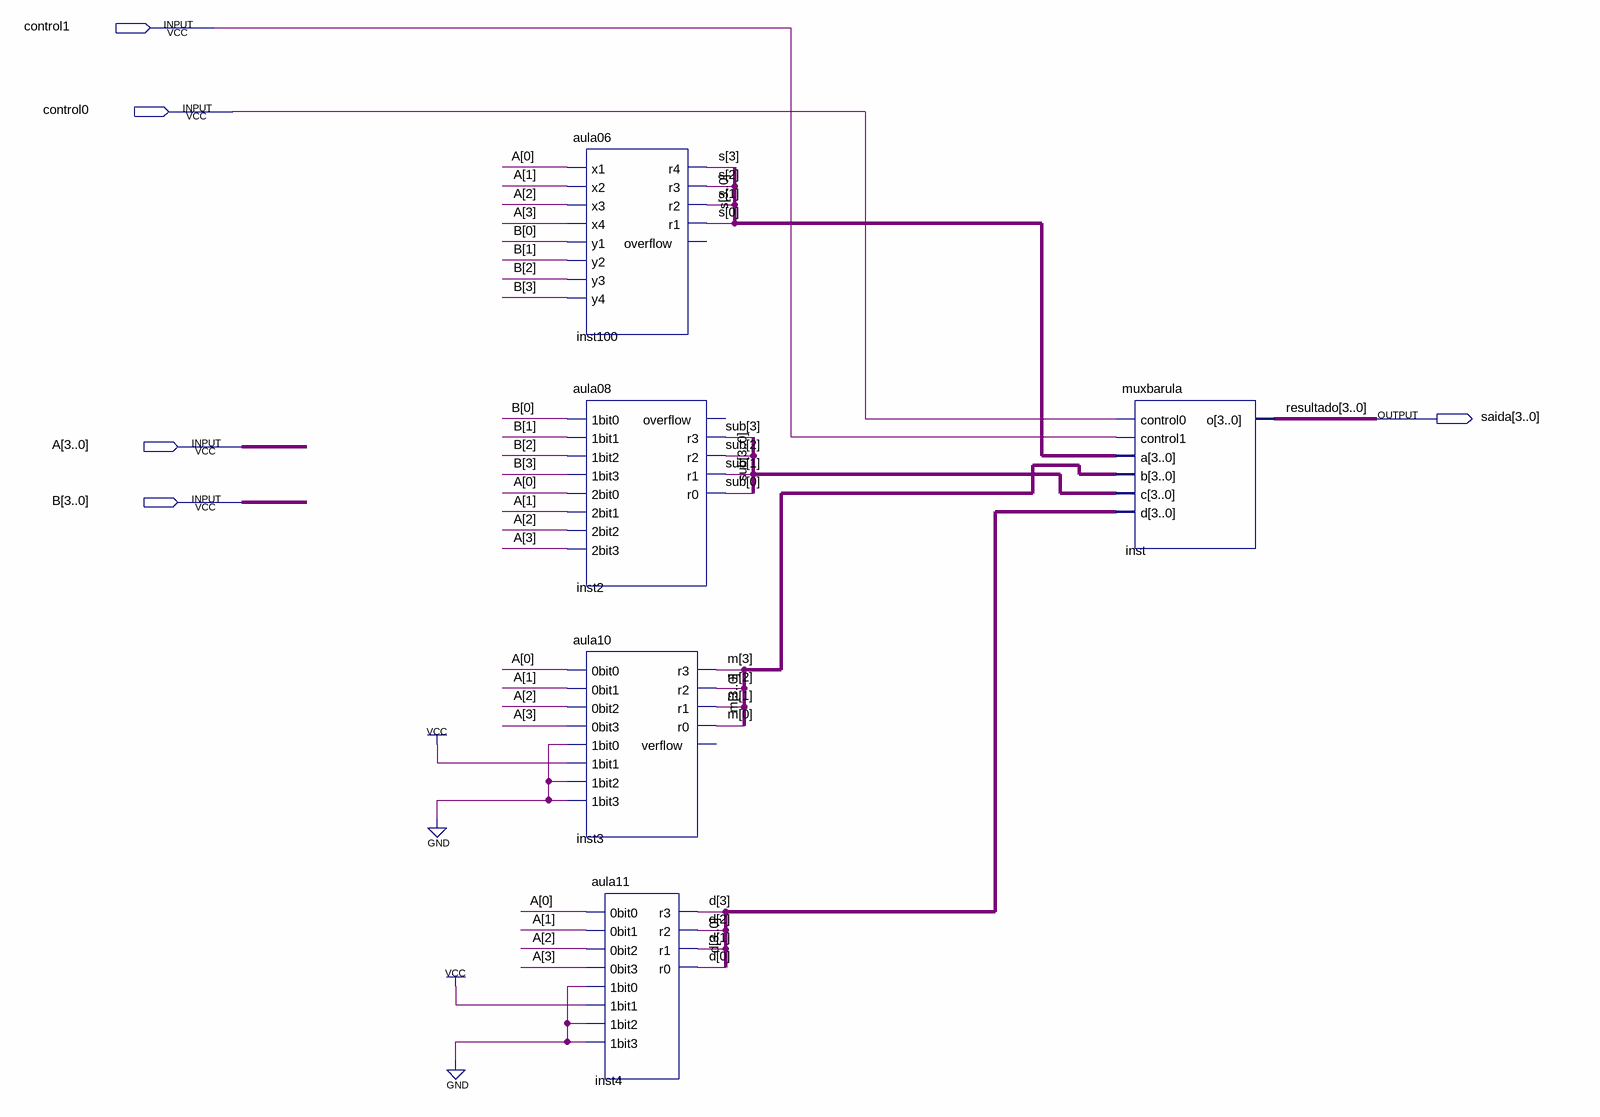
[diagram p0: schematic sheet]
// Quartus schematic ula.bdf as structural Verilog: 5 symbols, 5 pins
module ula (
  input  control1,
  input  control0,
  input  [3:0] A,
  input  [3:0] B,
  output [3:0] saida
);

  wire [3:0] d, m, s, sub;

  aula06 inst100 (
    .x1(A[0]), .x2(A[1]), .x3(A[2]), .x4(A[3]), .y1(B[0]), .y2(B[1]), .y3(B[2]), .y4(B[3]), .r4(s[3]),
    .r3(s[2]), .r2(s[1]), .r1(s[0]));  // open: overflow
  aula08 inst2 (
    .\1bit0 (B[0]), .\1bit1 (B[1]), .\1bit2 (B[2]), .\1bit3 (B[3]), .\2bit0 (A[0]), .\2bit1 (A[1]),
    .\2bit2 (A[2]), .\2bit3 (A[3]), .r3(sub[3]), .r2(sub[2]), .r1(sub[1]), .r0(sub[0]));  // open: overflow
  aula10 inst3 (
    .\0bit0 (A[0]), .\0bit1 (A[1]), .\0bit2 (A[2]), .\0bit3 (A[3]), .\1bit0 (1'b0), .\1bit1 (1'b1),
    .\1bit2 (1'b0), .\1bit3 (1'b0), .r3(m[3]), .r2(m[2]), .r1(m[1]), .r0(m[0]));  // open: verflow
  aula11 inst4 (
    .\0bit0 (A[0]), .\0bit1 (A[1]), .\0bit2 (A[2]), .\0bit3 (A[3]), .\1bit0 (1'b0), .\1bit1 (1'b1),
    .\1bit2 (1'b0), .\1bit3 (1'b0), .r3(d[3]), .r2(d[2]), .r1(d[1]), .r0(d[0]));
  muxbarula inst (.control0(control0), .control1(control1), .a(s), .b(m), .c(sub), .d(d), .o(saida));

  // Other names for the same wires on the sheet: resultado[3:0] = saida
endmodule
